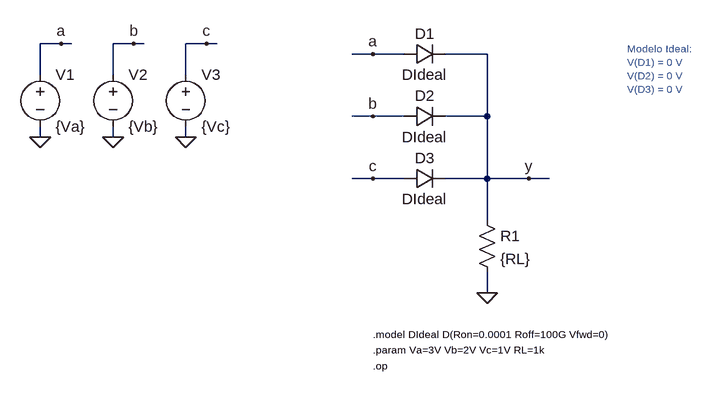
[diagram p0: schematic or_ideal.asc]
or_ideal.asc, the LTspice schematic file:
Version 4
SHEET 1 1376 680
WIRE -496 -112 -528 -112
WIRE -480 -112 -496 -112
WIRE -384 -112 -416 -112
WIRE -368 -112 -384 -112
WIRE -272 -112 -304 -112
WIRE -256 -112 -272 -112
WIRE -16 -96 -48 -96
WIRE 32 -96 -16 -96
WIRE 160 -96 96 -96
WIRE -528 -64 -528 -112
WIRE -416 -64 -416 -112
WIRE -304 -64 -304 -112
WIRE -16 0 -48 0
WIRE 32 0 -16 0
WIRE 160 0 160 -96
WIRE 160 0 96 0
WIRE -528 32 -528 16
WIRE -416 32 -416 16
WIRE -304 32 -304 16
WIRE -16 96 -48 96
WIRE 32 96 -16 96
WIRE 160 96 160 0
WIRE 160 96 96 96
WIRE 224 96 160 96
WIRE 256 96 224 96
WIRE 160 160 160 96
WIRE 160 272 160 240
FLAG 160 272 0
FLAG -304 32 0
FLAG -416 32 0
FLAG -528 32 0
FLAG -496 -112 a
FLAG -16 -96 a
FLAG -384 -112 b
FLAG -16 0 b
FLAG -272 -112 c
FLAG -16 96 c
FLAG 224 96 y
SYMBOL diode 32 -80 R270
WINDOW 0 32 32 VTop 2
WINDOW 3 0 32 VBottom 2
SYMATTR InstName D1
SYMATTR Value DIdeal
SYMBOL res 144 144 R0
SYMATTR InstName R1
SYMATTR Value {RL}
SYMBOL diode 32 16 R270
WINDOW 0 32 32 VTop 2
WINDOW 3 0 32 VBottom 2
SYMATTR InstName D2
SYMATTR Value DIdeal
SYMBOL diode 32 112 R270
WINDOW 0 32 32 VTop 2
WINDOW 3 0 32 VBottom 2
SYMATTR InstName D3
SYMATTR Value DIdeal
SYMBOL voltage -528 -80 R0
SYMATTR InstName V1
SYMATTR Value {Va}
SYMBOL voltage -416 -80 R0
SYMATTR InstName V2
SYMATTR Value {Vb}
SYMBOL voltage -304 -80 R0
SYMATTR InstName V3
SYMATTR Value {Vc}
TEXT -16 384 Left 1 !.op
TEXT -16 336 Left 1 !.model DIdeal D(Ron=0.0001 Roff=100G Vfwd=0)
TEXT 376 -104 Left 1 ;Modelo Ideal:\nV(D1) = 0 V\nV(D2) = 0 V\nV(D3) = 0 V
TEXT -16 360 Left 1 !.param Va=3V Vb=2V Vc=1V RL=1k

The netlist it stands for:
* or_ideal.asc
D1 a y DIdeal
R1 y 0 {RL}
D2 b y DIdeal
D3 c y DIdeal
V1 a 0 {Va}
V2 b 0 {Vb}
V3 c 0 {Vc}
.model D D
.lib standard.dio
.op
.model DIdeal D(Ron=0.0001 Roff=100G Vfwd=0)
* Modelo Ideal:
* V(D1) = 0 V
* V(D2) = 0 V
* V(D3) = 0 V
.param Va=3V Vb=2V Vc=1V RL=1k
.backanno
.end